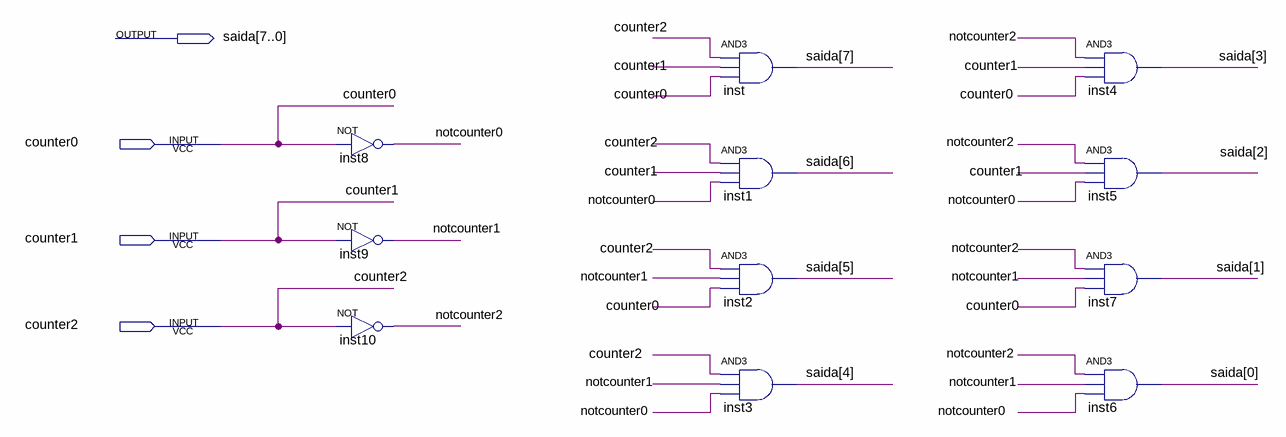
[diagram p0: schematic sheet]
// Quartus schematic DecoderContador.bdf as structural Verilog: 11 symbols, 4 pins
module DecoderContador (
  input  counter0,
  input  counter1,
  input  counter2,
  output [7:0] saida
);

  wire notcounter0, notcounter1, notcounter2;

  not inst8 (notcounter0, counter0);
  not inst9 (notcounter1, counter1);
  not inst10 (notcounter2, counter2);
  and inst (saida[7], counter2, counter1, counter0);
  and inst1 (saida[6], counter2, counter1, notcounter0);
  and inst2 (saida[5], counter2, notcounter1, counter0);
  and inst3 (saida[4], counter2, notcounter1, notcounter0);
  and inst4 (saida[3], notcounter2, counter1, counter0);
  and inst5 (saida[2], notcounter2, counter1, notcounter0);
  and inst7 (saida[1], notcounter2, notcounter1, counter0);
  and inst6 (saida[0], notcounter2, notcounter1, notcounter0);
endmodule
